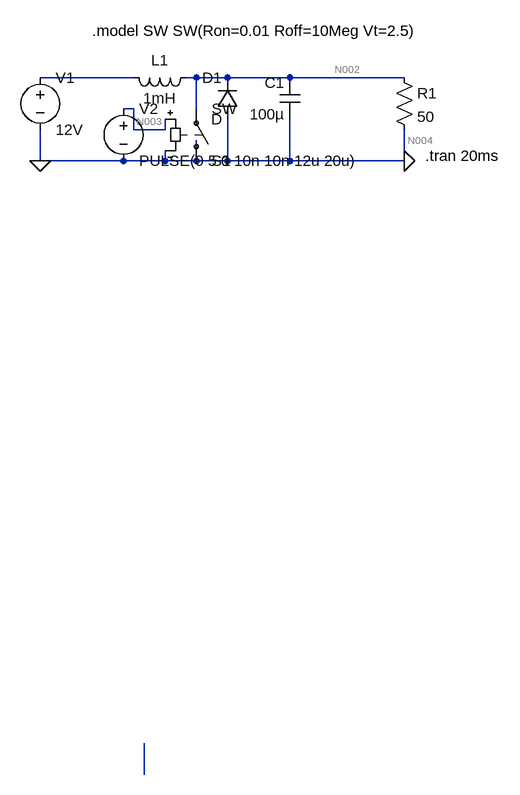
[diagram p0: schematic Draft2.asc]
Draft2.asc, the LTspice schematic file:
Version 4.1
SHEET 1 880 1156
WIRE 32 80 -112 80
WIRE 128 80 112 80
WIRE 176 80 128 80
WIRE 272 80 176 80
WIRE 448 80 272 80
WIRE 32 128 16 128
WIRE 128 128 128 80
WIRE 32 160 32 128
WIRE 80 160 80 144
WIRE 80 160 32 160
WIRE 448 192 448 160
WIRE -112 208 -112 160
WIRE 16 208 -96 208
WIRE 80 208 80 192
WIRE 80 208 16 208
WIRE 128 208 128 176
WIRE 128 208 80 208
WIRE 176 208 176 144
WIRE 176 208 128 208
WIRE 272 208 272 144
WIRE 272 208 176 208
WIRE 448 208 272 208
WIRE 48 1152 48 1104
FLAG -112 208 0
FLAG 448 208 0
SYMBOL voltage -112 64 R0
WINDOW 123 0 0 Left 0
WINDOW 39 0 0 Left 0
SYMATTR InstName V1
SYMATTR Value 12V
SYMBOL ind 128 64 R90
WINDOW 0 5 56 VBottom 2
WINDOW 3 32 56 VTop 2
SYMATTR InstName L1
SYMATTR Value 1mH
SYMATTR SpiceLine Rser=1m
SYMBOL diode 192 144 R180
WINDOW 0 24 64 Left 2
WINDOW 3 24 0 Left 2
SYMATTR InstName D1
SYMBOL cap 288 144 R180
WINDOW 0 24 56 Left 2
WINDOW 3 24 8 Left 2
SYMATTR InstName C1
SYMATTR Value 100µ
SYMBOL res 432 64 R0
SYMATTR InstName R1
SYMATTR Value 50
SYMBOL voltage 16 112 R0
WINDOW 123 0 0 Left 0
WINDOW 39 0 0 Left 0
SYMATTR InstName V2
SYMATTR Value PULSE(0 5 0 10n 10n 12u 20u)
SYMBOL sw 128 224 M180
SYMATTR InstName S1
TEXT 480 200 Left 2 !.tran 20ms
TEXT -32 8 Left 2 !.model SW SW(Ron=0.01 Roff=10Meg Vt=2.5)

The netlist it stands for:
* Draft2.asc
V1 N001 0 12V
L1 N002 N001 1mH Rser=1m
D1 0 N002 D
C1 0 N002 100µ
R1 N002 N004 50
V2 N003 0 PULSE(0 5 0 10n 10n 12u 20u)
S1 0 N002 N003 0 SW
.model D D
.lib standard.dio
.tran 20ms
.model SW SW(Ron=0.01 Roff=10Meg Vt=2.5)
.backanno
.end

* Results of the author's LTspice run, read from the files saved beside the schematic
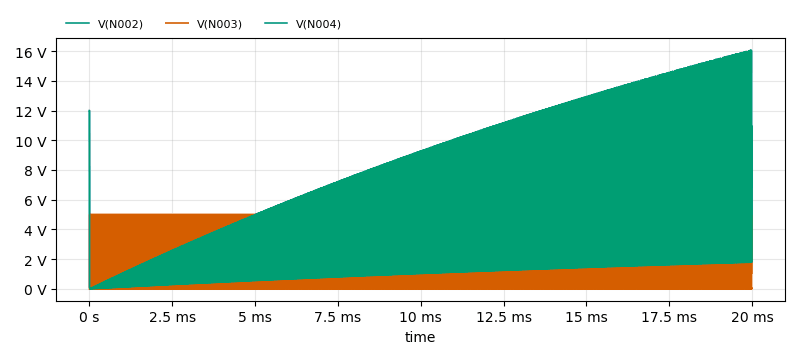
[diagram p1: Transient Analysis of Draft2.asc, plotted from the saved traces]
* Transient Analysis, 1 run:
*   V(N002): min 1.237 mV, max 16.08 V, average 2.955 V, rms 4.397 V, last 16.08 V
*   V(N003): min 0 V, max 5 V, average 3.002 V, rms 3.874 V, last 0 V
*   V(N004): min 1.237 mV, max 16.08 V, average 2.955 V, rms 4.397 V, last 16.08 V